# Altium schematic sheet Gesamtübersicht.SchDoc
size A4
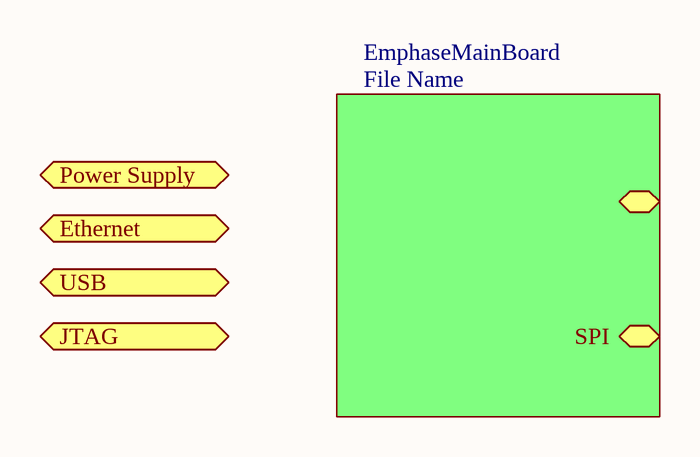
[diagram p0: Gesamtübersicht.SchDoc]

## Sub-sheets
EmphaseMainBoard = File Name: SPI, 

## Ports
Ethernet, JTAG, Power Supply, USB